# Altium schematic sheet ATMEGA8_S52.SchDoc
size A4
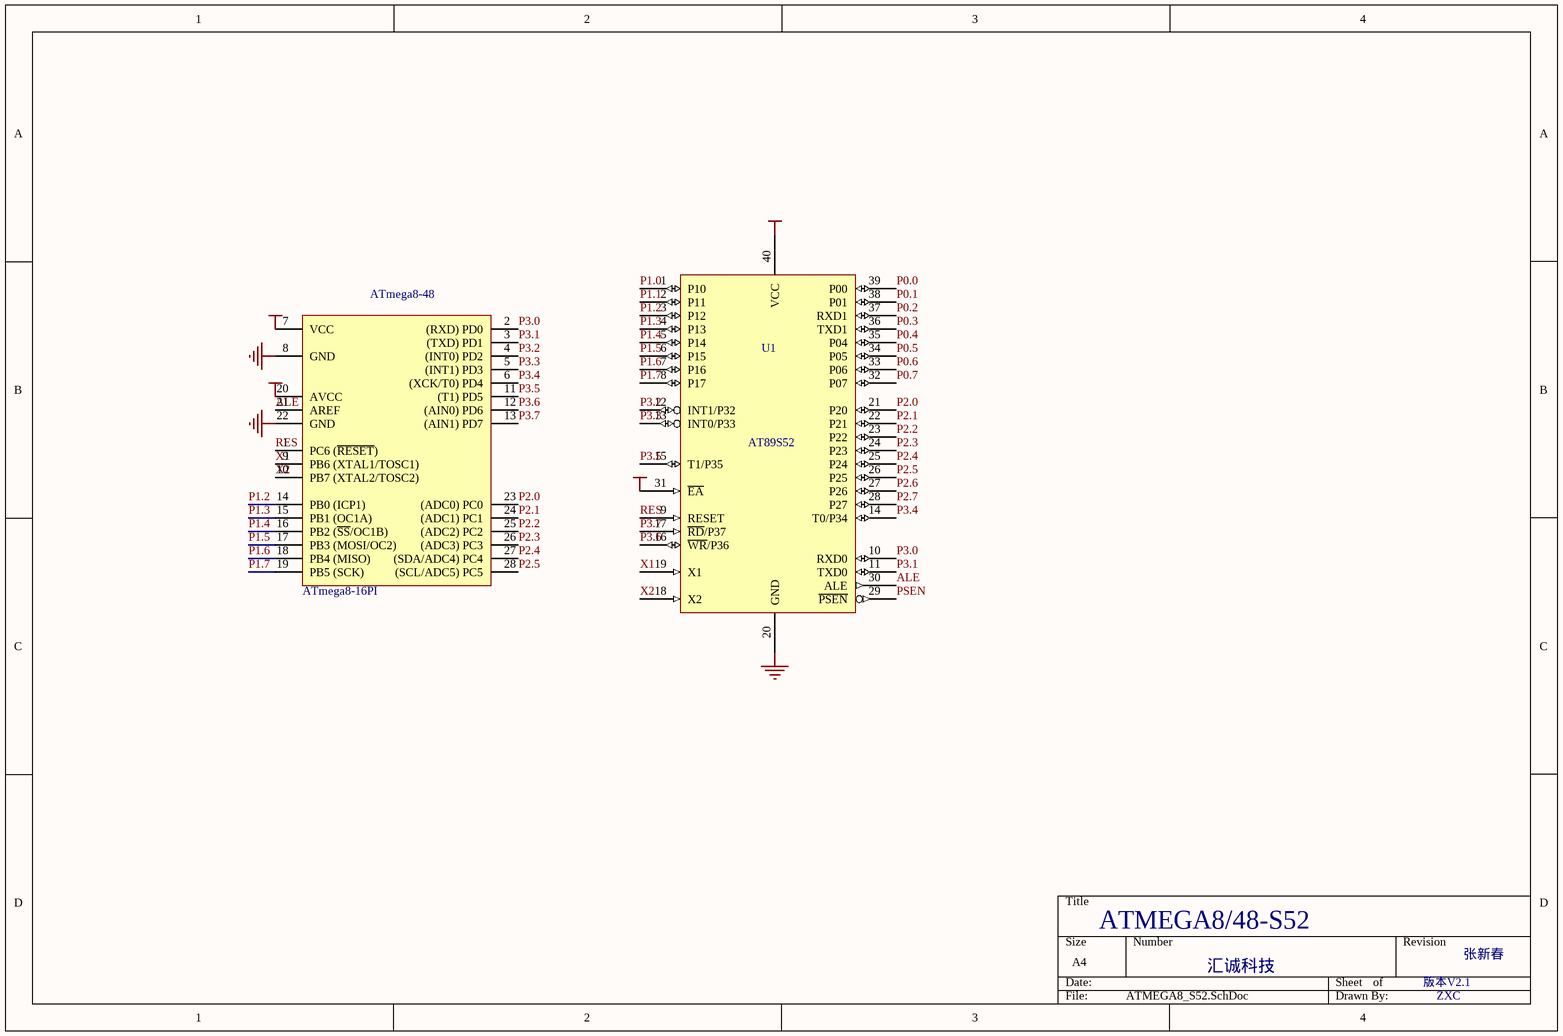
[diagram p0: ATMEGA8_S52.SchDoc]

## Parts
ATmega8-48  ATmega8-16PI  [底座DIP-28/引脚7.62mm]
U1  AT89S52  [DIP-40]

## Nets
GND: ATmega8-48.8(GND) ATmega8-48.22(GND) U1.20(GND)
VCC: ATmega8-48.7(VCC) ATmega8-48.20(AVCC) U1.31(~{EA}) U1.40(VCC)
ALE: ATmega8-48.21(AREF) U1.30(ALE)
P0.0: U1.39(P00)
P0.1: U1.38(P01)
P0.2: U1.37(RXD1)
P0.3: U1.36(TXD1)
P0.4: U1.35(P04)
P0.5: U1.34(P05)
P0.6: U1.33(P06)
P0.7: U1.32(P07)
P1.0: U1.1(P10)
P1.1: U1.2(P11)
P1.2: ATmega8-48.14(PB0_(ICP1)) U1.3(P12)
P1.3: ATmega8-48.15(PB1_(OC1A)) U1.4(P13)
P1.4: ATmega8-48.16(PB2_(~{SS}/OC1B)) U1.5(P14)
P1.5: ATmega8-48.17(PB3_(MOSI/OC2)) U1.6(P15)
P1.6: ATmega8-48.18(PB4_(MISO)) U1.7(P16)
P1.7: ATmega8-48.19(PB5_(SCK)) U1.8(P17)
P2.0: ATmega8-48.23((ADC0)_PC0) U1.21(P20)
P2.1: ATmega8-48.24((ADC1)_PC1) U1.22(P21)
P2.2: ATmega8-48.25((ADC2)_PC2) U1.23(P22)
P2.3: ATmega8-48.26((ADC3)_PC3) U1.24(P23)
P2.4: ATmega8-48.27((SDA/ADC4)_PC4) U1.25(P24)
P2.5: ATmega8-48.28((SCL/ADC5)_PC5) U1.26(P25)
P2.6: U1.27(P26)
P2.7: U1.28(P27)
P3.0: ATmega8-48.2((RXD)_PD0) U1.10(RXD0)
P3.1: ATmega8-48.3((TXD)_PD1) U1.11(TXD0)
P3.2: ATmega8-48.4((INT0)_PD2) U1.12(INT1/P32)
P3.3: ATmega8-48.5((INT1)_PD3) U1.13(INT0/P33)
P3.4: ATmega8-48.6((XCK/T0)_PD4) U1.14(T0/P34)
P3.5: ATmega8-48.11((T1)_PD5) U1.15(T1/P35)
P3.6: ATmega8-48.12((AIN0)_PD6) U1.16(~{WR}/P36)
P3.7: ATmega8-48.13((AIN1)_PD7) U1.17(~{RD}/P37)
PSEN: U1.29(~{PSEN})
RES: ATmega8-48.1(PC6_(~{RESET})) U1.9(RESET)
X1: ATmega8-48.9(PB6_(XTAL1/TOSC1)) U1.19(X1)
X2: ATmega8-48.10(PB7_(XTAL2/TOSC2)) U1.18(X2)

## Notes on the sheet
- ATMEGA8/48-S52
- 汇诚科技
- 版本V2.1
- 张新春
- ZXC

## Library data of the parts
ATmega8-48 = ATmega8-P: 8 位微处理器/28引脚; 子类别: 微处理器; 发布者: 磊元工作室; 发布日期: 2003年8月18日; 制造商: Atmel Corporation; 类别: 集成电路; 元件名称（国标）: 8 位微处理器; 元件名称（英文）: 8-bit Microcontroller; 特性:存储器容量: Flash：8KB ，EEPROM：512B ，RAM：1KB; 特性:定时器/计数器: 2 个 8-bit ，1 个 16-bit; 特性:模/数转换器: 6 通道 10-bit ADC; 特性:指令: 两个时钟周期的硬件乘法器
U1 = 8051